# Altium project Heatedbed.PrjPcb
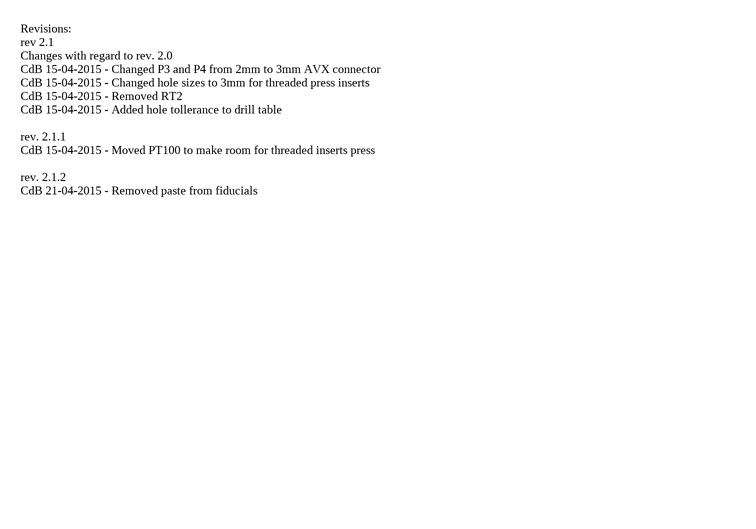
[diagram p0: Revisions.SchDoc]
2 sheets, 8 parts. Net scope: global (net labels, ports and power ports of the same name join across sheets).
Board file: Heatedbed.PcbDoc
Sheets:
  Revisions.SchDoc
  Heatedbed.SchDoc

## Sheet Revisions.SchDoc: Heated bed
size A4; CompanyName: Ultimaker B.V.; DrawnBy: Coen de Boer; Engineer: Coen de Boer; Revision: 2.1.2; DocumentName: Heated bed; Rule: PcbType=ProtelPcb

### Notes on the sheet
- Revisions:
  rev 2.1
  Changes with regard to rev. 2.0
  CdB 15-04-2015 - Changed P3 and P4 from 2mm to 3mm AVX connector
  CdB 15-04-2015 - Changed hole sizes to 3mm for threaded press inserts
  CdB 15-04-2015 - Removed RT2
  CdB 15-04-2015 - Added hole tollerance to drill table
  rev. 2.1.1
  CdB 15-04-2015 - Moved PT100 to make room for threaded inserts press
  rev. 2.1.2
  CdB 21-04-2015 - Removed paste from fiducials
- Title
- Size:
- Date:
- A4
- Number:
- Time:
- Revision:
- Sheet
- of
- File:

## Sheet Heatedbed.SchDoc: Heated bed
size A4; CompanyName: Ultimaker B.V.; DrawnBy: Coen de Boer; Engineer: Coen de Boer; Revision: 2.1.2
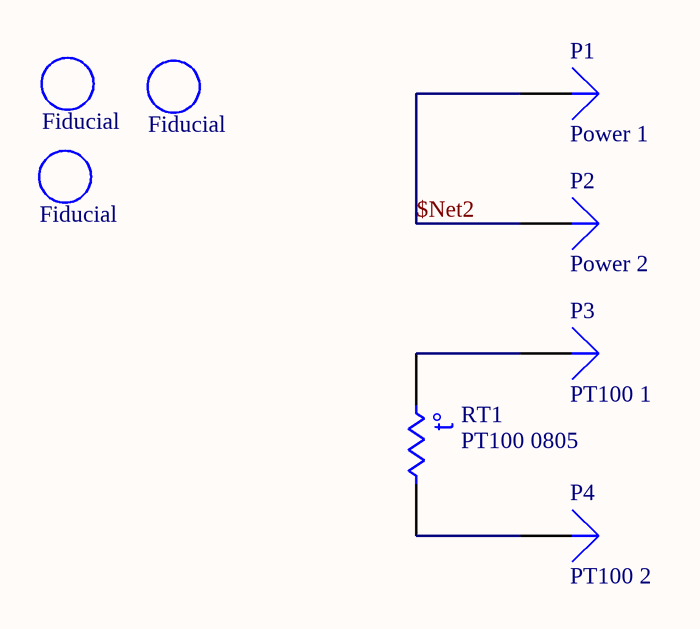
[diagram p1: Heatedbed.SchDoc]

### Parts
Fid1  Fiducial  [Fiducial]  (no BOM)
Fid2  Fiducial  [Fiducial]  (no BOM)
Fid3  Fiducial  [Fiducial]  (no BOM)
P1  Power 1  [AVX Poke home contact]
P2  Power 2  [AVX Poke home contact]
P3  PT100 1  [AVX POKE HOME CONTACT 3MM]
P4  PT100 2  [AVX POKE HOME CONTACT 3MM]
RT1  PT100 0805  [6-0805_M]

### Nets
$Net2: P1.1 P2.1
NetP3_1: P3.1 RT1.1
NetP4_1: P4.1 RT1.2

### Notes on the sheet
- Title
- Size:
- Date:
- A4
- Number:
- Time:
- Revision:
- Sheet
- of
- File:
- (in symbol Res Thermal) t°

### Library data of the parts
Fid1-Fid3 = Library_MISC-0003: ID: Library_MISC-0003; Faber ItemCode: -; Mfg: -; Mfg code: -; Value: Fiducial
P1 P2 = Plug: Mfg: AVX; Mfg code: 70-9296-001-004-006; LatestRevisionDate: 17-Jul-2002; LatestRevisionNote: Re-released for DXP Platform.; Publisher: Altium Limited
P3 P4 = Plug: Mfg: AVX; Mfg code: 70-9296-001-003-006; LatestRevisionDate: 17-Jul-2002; LatestRevisionNote: Re-released for DXP Platform.; Publisher: Altium Limited
RT1 = Res Thermal: Thermistor; Mfg: IST INNOVATIVE SENSOR TECHNOLOGY; Mfg code: P0K1.0805.2P.B; Published: 24-Mar-1999; LatestRevisionDate: 29-May-2009; LatestRevisionNote: IPC-7351 Footprint Added.; PackageVersion: Mar-2003; PackageReference: 6-0805; Publisher: Altium Limited; PackageDescription: Chip Resistor 0805 Case Size; Code_IPC: RESC2012